# Altium project Satellite_ZR16S08.PrjPcb
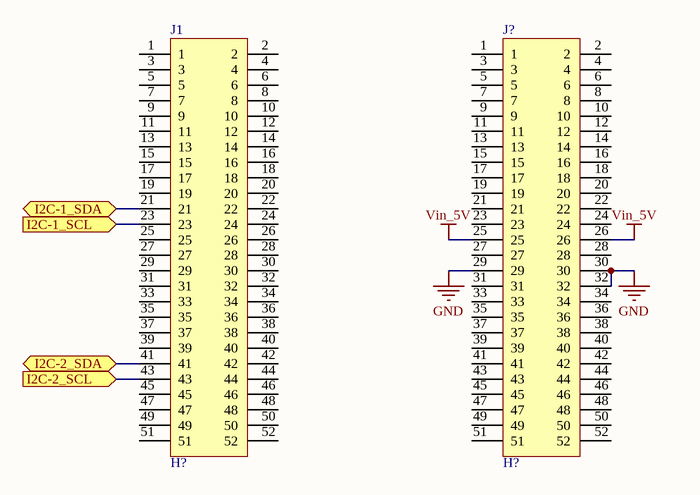
[diagram p0: Connectors.SchDoc]
3 sheets, 29 parts. Net scope: flat (ports and power ports of the same name join across sheets).
Board file: PCB1.PcbDoc
Sheets:
  Connectors.SchDoc
  I2C-SPI_Communication.SchDoc
  Fonte_zr_obc.SchDoc

## Sheet Connectors.SchDoc
size A4

### Parts
J1  H?  [ESQ_26]
J?  H?  [ESQ_26]

### Ports
I2C-1_SCL (in), I2C-1_SDA (bidir), I2C-2_SCL (in), I2C-2_SDA (bidir)

### Nets
GND: J?.29 J?.30 J?.32
Vin_5V: J?.25 J?.26
NetJ1_21: J1.21 ; port I2C-1_SDA
NetJ1_23: J1.23 ; port I2C-1_SCL
NetJ1_41: J1.41 ; port I2C-2_SDA
NetJ1_43: J1.43 ; port I2C-2_SCL

Not connected (* = marked no-connect by the designer): J1 1 2 3 4 5 6 7 8 9 10 11 12 13 14 15 16 17 18 19 20 22 24 25 26 27 28 29 30 31 32 33 34 35 36 37 38 39 40 42 44 45 46 47 48 49 50 51 52; J? 1 2 3 4 5 6 7 8 9 10 11 12 13 14 15 16 17 18 19 20 21 22 23 24 27 28 31 33 34 35 36 37 38 39 40 41 42 43 44 45 46 47 48 49 50 51 52

### Library data of the parts
J1 J? = ESQ_126_49_GD: eVendor: *; eVendor Part#: *; eVendor Price: *; Manufacturer: *; MOQ: *; MSRP: *; Part#: *

## Sheet I2C-SPI_Communication.SchDoc
size A4
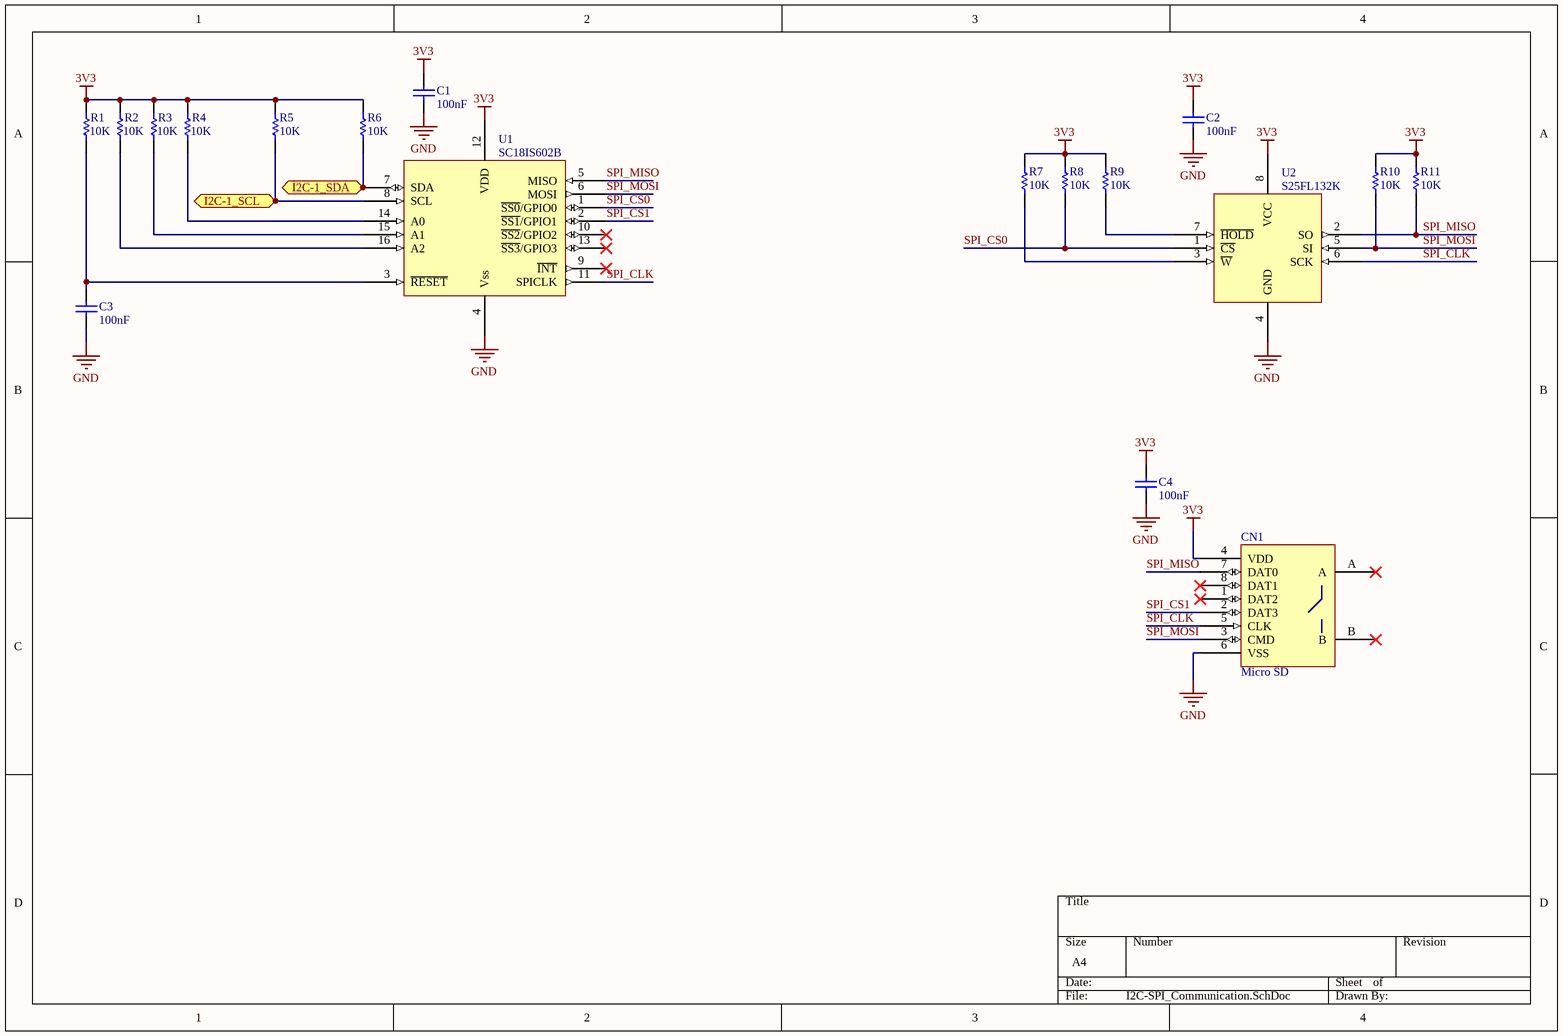
[diagram p1: I2C-SPI_Communication.SchDoc]

### Parts
C1  100nF  [CC1005-0402]
C2  100nF  [CC1005-0402]
C3  100nF  [CC1005-0402]
C4  100nF  [CC1005-0402]
CN1  Micro SD  [MICROSD]
R1  value 10K  [AXIAL-0.3]  (hidden comment: Res1)
R2  value 10K  [AXIAL-0.3]  (hidden comment: Res1)
R3  value 10K  [AXIAL-0.3]  (hidden comment: Res1)
R4  value 10K  [AXIAL-0.3]  (hidden comment: Res1)
R5  10K  [CR1005-0402_NP]
R6  10K  [CR1005-0402_NP]
R7  10K  [CR1005-0402]
R8  10K  [CR1005-0402]
R9  10K  [CR1005-0402]
R10  10K  [CR1005-0402]
R11  10K  [CR1005-0402]
U1  SC18IS602B  [TSSOP-16N]
U2  S25FL132K  [SOIC-8N]

### Ports
I2C-1_SCL (in), I2C-1_SDA (bidir)

### Nets
3V3: C1.2 C2.2 C4.2 CN1.4(VDD) R1.2 R2.2 R3.2 R4.2 R5.2 R6.2 R7.2 R8.2 R9.2 R10.2 R11.2 U1.12(VDD) U2.8(VCC)
GND: C1.1 C2.1 C3.1 C4.1 CN1.6(VSS) U1.4(Vss) U2.4(GND)
SPI_CLK: CN1.5(CLK) U1.11(SPICLK) U2.6(SCK)
SPI_CS0: R8.1 U1.1(~{SS0}/GPIO0) U2.1(~{CS})
SPI_CS1: CN1.2(DAT3) U1.2(~{SS1}/GPIO1)
SPI_MISO: CN1.7(DAT0) R11.1 U1.5(MISO) U2.2(SO)
SPI_MOSI: CN1.3(CMD) R10.1 U1.6(MOSI) U2.5(SI)
NetC3_2: C3.2 R1.1 U1.3(~{RESET})
NetJ1_21: R6.1 U1.7(SDA) ; port I2C-1_SDA
NetJ1_23: R5.1 U1.8(SCL) ; port I2C-1_SCL
NetR2_1: R2.1 U1.16(A2)
NetR3_1: R3.1 U1.15(A1)
NetR4_1: R4.1 U1.14(A0)
NetR7_1: R7.1 U2.3(~{W})
NetR9_1: R9.1 U2.7(~{HOLD})

Not connected (* = marked no-connect by the designer): CN1 1(DAT2)* 8(DAT1)* A* B*; U1 9(~{INT})* 10(~{SS2}/GPIO2)* 13(~{SS3}/GPIO3)*

### Library data of the parts
C1 C2 C4 = Capacitor: CAP CER 0.1UF 16V 10% X7R 0402; eVendor Part#: 490-3261-1-ND; Manufacturer: Murata Electronics North America; Part#: GRM155R71C104KA88D; eVendor: Digikey; eVendor Price: 0,1; MSRP: 0,00375; MOQ: 1000; NP: NP
C3 = Capacitor: eVendor: *; eVendor Price: *; eVendor Part#: *; Manufacturer: *; Part#: *; MOQ: *; MSRP: *; NP: NP
CN1 = Micro SD: CONN MICRO SD R/A PUSH-PULL SMD; eVendor Part#: HR1941CT-ND; Manufacturer: Hirose Electric Co Ltd; Part#: DM3D-SF; eVendor: Digikey; eVendor Price: 1,92; MSRP: 0,7847; MOQ: 1000; NP: NP
R1-R4 = Res1: Resistor; Published: 8-Jun-2000; LatestRevisionDate: 17-Jul-2002; LatestRevisionNote: Re-released for DXP Platform.; PackageReference: AXIAL-0.3; Publisher: Altium Limited; PackageDescription: Axial Device, Thru-Hole; 2 Leads; 0.3 in Pin Spacing
R5 R6 = Resistor: eVendor: *; eVendor Price: *; Manufacturer: *; MSRP: *; MOQ: *; Part#: *; NP: NP
R7-R11 = Resistor: RES SMD 10K OHM 1% 1/10W 0402; eVendor Part#: P10.0KLCT-ND; Manufacturer: Panasonic Electronic Components; Part#: ERJ-2RKF1002X; eVendor: Digikey; eVendor Price: 0,1; MSRP: 0,00544; MOQ: 1000; NP: NP
U1 = SC18IS602B: IC BRIDGE I2C/SPI 16-TSSOP; eVendorPart#: 568-10300-1-ND; Manufacturer: NXP USA Inc; Part#: SC18IS602BIPW,128; eVendor: Digikey; eVendorPrice: 2,73; MSRP: 2,00850; MOQ: 100
U2 = S25FL132K: Flash 32Mb, 3V, 108Mhz CMOS SPI Flash; Manufacturer: Spansion; eVendor Part#: 797-25FL132K0XMFI041; Part#: S25FL132K0XMFI041; eVendor: Mouser; eVendor Price: 0,58; MSRP: 0,44; MOQ: 1000; NP: NP

## Sheet Fonte_zr_obc.SchDoc
size A4
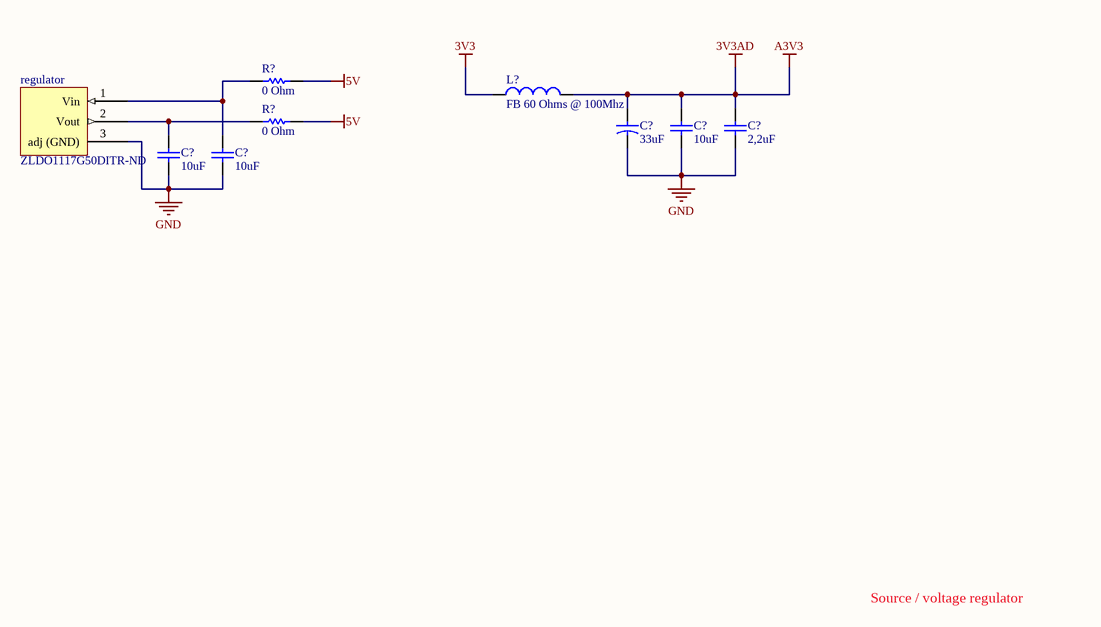
[diagram p2: Fonte_zr_obc.SchDoc]

### Parts
(Parts that share a designator on the sheet are numbered #1, #2 ... from top to bottom, then left to right.)
C?#1  33uF  [CC3216-1206]
C?#2  10uF  [CC1005-0402]
C?#3  2,2uF  [CC1005-0402]
C?#4  10uF  [CC1005-0402]
C?#5  10uF  [CC1005-0402]
L?  FB 60 Ohms @ 100Mhz  [IND_VLF3012]
R?#1  0 Ohm  [CR1005-0402_NP]
R?#2  0 Ohm  [CR1005-0402_NP]
regulator  ZLDO1117G50DITR-ND

### Nets
3V3: L?.1
3V3AD: C?#1.1 C?#2.2 C?#3.2 L?.2  [also labelled A3V3]
5V: R?#1.1 R?#2.1
GND: C?#1.2 C?#2.1 C?#3.1 C?#4.1 C?#5.1 regulator.3(adj_(GND))
NetC?#4_2: C?#4.2 R?#2.2 regulator.2(Vout)
NetC?#5_2: C?#5.2 R?#1.2 regulator.1(Vin)

### Notes on the sheet
- Source / voltage regulator

### Library data of the parts
C?#1 = Capacitor_Tan: Capacitor Tantalum; eVendor: *; eVendorPart#: *; Part#: *; eVendorPrice: *; MOQ: *; Manufacturer: *; MSRP: *
C?#2-C?#5 = Capacitor: eVendor: *; eVendor Price: *; eVendor Part#: *; Manufacturer: *; Part#: *; MOQ: *; MSRP: *; NP: NP
L? = Inductor: eVendor: *; eVendor Price: *; Part#: *; MOQ: *; Manufacturer: *; MSRP: *; eVendor Part#: *; NP: NP
R?#1 R?#2 = Resistor: eVendor: *; eVendor Price: *; Manufacturer: *; MSRP: *; MOQ: *; Part#: *; NP: NP
regulator = dropout_linear_regulator: Manufacturer: Diodes Incorporated; eVendor: Digikey; eVendeor Price: 0.50000; MSRP: 0.24926; eVendor Part#: ZLDO1117G50DITR-ND; MOQ: 500

## Nets that join several sheets
3V3: I2C-SPI_Communication (17 pins), Fonte_zr_obc (L?.1)
GND: Connectors (J?.29 J?.30 J?.32), I2C-SPI_Communication (7 pins), Fonte_zr_obc (6 pins)
NetJ1_21: Connectors (J1.21), I2C-SPI_Communication (R6.1 U1.7)
NetJ1_23: Connectors (J1.23), I2C-SPI_Communication (R5.1 U1.8)